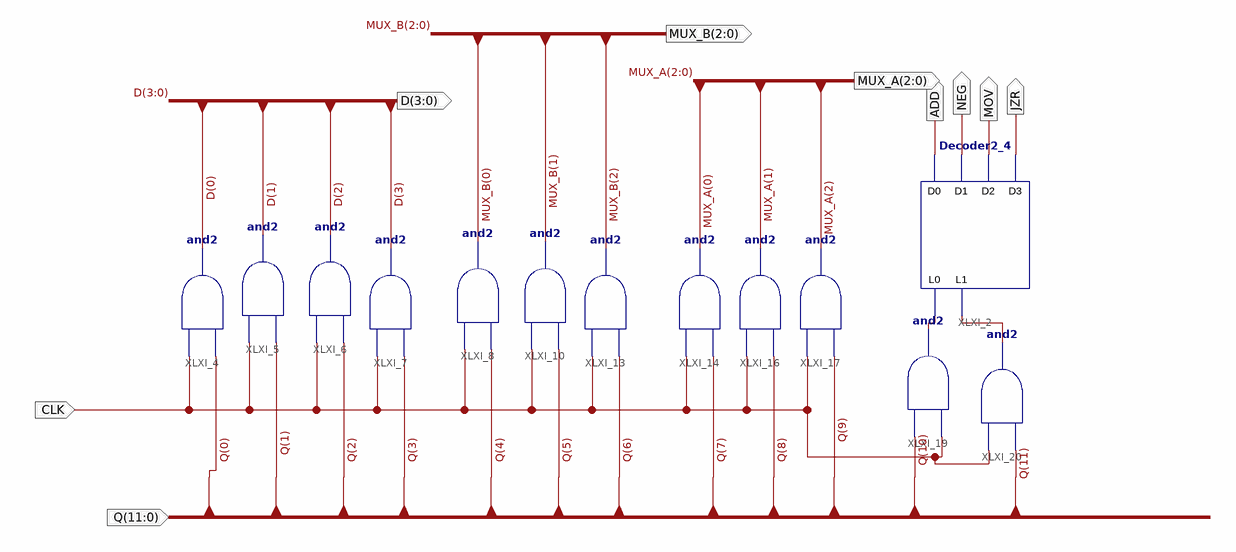
[diagram p0: schematic sheet 1]
// Xilinx ISE schematic INS_DECODER.sch (spartan3e) as structural Verilog: 13 symbols, 9 ports
module INS_DECODER (
  input  [11:0] Q,
  input  CLK,
  output ADD,
  output NEG,
  output MOV,
  output JZR,
  output [3:0] D,
  output [2:0] MUX_A,
  output [2:0] MUX_B
);

  wire XLXN_55, XLXN_57;

  Decoder2_4 XLXI_2 (.D0(ADD), .D1(NEG), .D2(MOV), .D3(JZR), .L0(XLXN_55), .L1(XLXN_57));
  and XLXI_4 (D[0], Q[0], CLK);
  and XLXI_5 (D[1], Q[1], CLK);
  and XLXI_6 (D[2], Q[2], CLK);
  and XLXI_7 (D[3], Q[3], CLK);
  and XLXI_8 (MUX_B[0], Q[4], CLK);
  and XLXI_10 (MUX_B[1], Q[5], CLK);
  and XLXI_13 (MUX_B[2], Q[6], CLK);
  and XLXI_14 (MUX_A[0], Q[7], CLK);
  and XLXI_16 (MUX_A[1], Q[8], CLK);
  and XLXI_17 (MUX_A[2], Q[9], CLK);
  and XLXI_19 (XLXN_55, CLK, Q[10]);
  and XLXI_20 (XLXN_57, Q[11], CLK);
endmodule
